# EAGLE design magnetic_encoder (EAGLE 7.2.0)
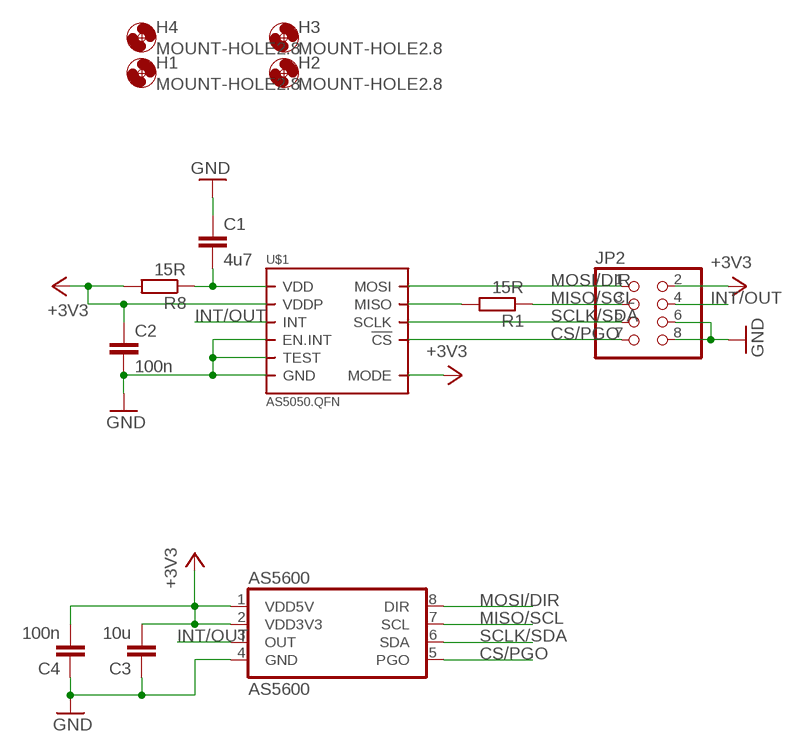
[diagram p0: schematic, sheet 1]

## Parts
AS5600  AS5600  [SOIC-8]
C1  4u7  C-EUC0603  [C0603]
C2  100n  C-EUC0603  [C0603]
C3  10u  C-EUC0603  [C0603]
C4  100n  C-EUC0603  [C0603]
H1  MOUNT-HOLE2.8  [2,8]
H2  MOUNT-HOLE2.8  [2,8]
H3  MOUNT-HOLE2.8  [2,8]
H4  MOUNT-HOLE2.8  [2,8]
JP2  PINHD-2X4  [2X04]
R1  15R  R-EU_R0603  [R0603]
R8  15R  R-EU_R0603  [R0603]
U$1  AS5050.QFN  [QFN.16]

## Nets
+3V3: AS5600.1(VDD5V) AS5600.2(VDD3V3) C2.1 C3.2 C4.2 JP2.2 R8.2 U$1.11(VDDP) U$1.14(MODE)
CS/PGO: AS5600.5(PGO) JP2.7 U$1.4(!CS)
GND: AS5600.4(GND) C1.1 C2.2 C3.1 C4.1 JP2.6 JP2.8 U$1.9(TEST) U$1.10(EN.INT) U$1.13(GND)
INT/OUT: AS5600.3(OUT) JP2.4 U$1.15(INT)
MISO/SCL: AS5600.7(SCL) JP2.3 R1.1
MOSI/DIR: AS5600.8(DIR) JP2.1 U$1.1(MOSI)
N$1: C1.2 R8.1 U$1.12(VDD)
N$3: R1.2 U$1.2(MISO)
SCLK/SDA: AS5600.6(SDA) JP2.5 U$1.3(SCLK)

## Library data of the parts
AS5600 = austriamicrosystems:AS5600
C1-C4 = rcl:C-EU: CAPACITOR, European symbol
H1-H4 = holes:MOUNT-HOLE: MOUNTING HOLE with drill center marker
JP2 = Headerlibrary:PINHD-2X4: PIN HEADER
R1 R8 = rcl:R-EU_: RESISTOR, European symbol
U$1 = austriamicrosystems:AS5050

## Net classes
0 default: width 0.203 mm

## Board
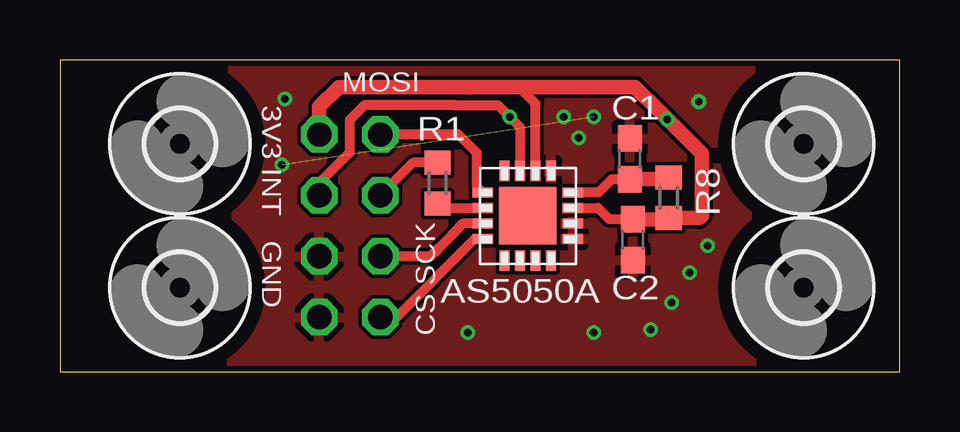
[diagram p1: board, top side]
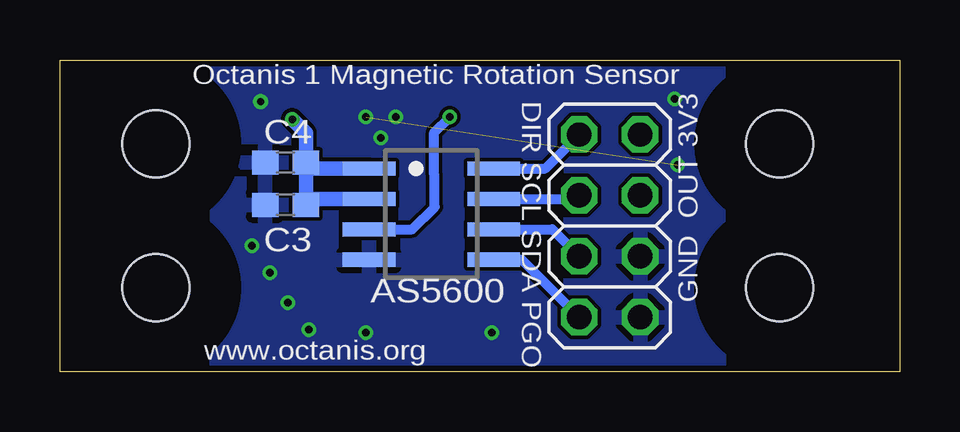
[diagram p2: board, bottom side, seen from below]

Size 35 x 13 mm. Coordinates in mm from the lower left corner, seen from the top.
Outline: 0,0 35,0 35,13 0,13 0,0
Copper layers (1*16): Top 0.035mm / dielectric 1.5mm / Bottom 0.035mm
Design rules "SeeedStudio_2layer_DRU_no_angle_20140221": minimum track width 6mil, minimum drill 12mil, track to track 6mil, track to pad 6mil, pad to pad 6mil, via to via 6mil, smd to smd 0mil, copper to edge 10mil, drill to drill 10mil, minimum pad ring 10mil, minimum via ring 6mil, stop-mask expansion 2mil, vias tented up to drill 100mil, thermal gap 10mil

### Footprints (pad centres in the part's own frame; a part is rotated, then mirrored left to right if it is on the bottom)
SOIC-8 = smd 0.6 x 2.2: 1 -1.215,-2.62; 2 0.055,-2.62; 3 1.325,-2.62; 4 2.595,-2.62; 5 2.595,2.58; 6 1.325,2.58; 7 0.055,2.58; 8 -1.215,2.58
C0603 = smd 1.1 x 1: 1 -0.85,0; 2 0.85,0
2,8 = hole 2.8: 0,0
2X04 = drill 1.016 octagon: 1 -3.81,-1.27; 2 -3.81,1.27; 3 -1.27,-1.27; 4 -1.27,1.27; 5 1.27,-1.27; 6 1.27,1.27; 7 3.81,-1.27; 8 3.81,1.27
R0603 = smd 1 x 1.1: 1 -0.85,0; 2 0.85,0
QFN.16 = smd 0.85 x 0.42: 1 -1.875,0.975; 2 -1.875,0.325; 3 -1.875,-0.325; 4 -1.875,-0.975; 9 1.875,-0.975; 10 1.875,-0.325; 11 1.875,0.325; 12 1.875,0.975 | smd 0.42 x 0.85: 5 -0.975,-1.875; 6 -0.325,-1.875; 7 0.325,-1.875; 8 0.975,-1.875; 13 0.975,1.875; 14 0.325,1.875; 15 -0.325,1.875; 16 -0.975,1.875 | smd 2.4 x 2.4: PAD 0,0

### Placement (x,y rotation side)
AS5600  19.5,7.25 270 bottom
C1  23.75,8.88 270 top
C2  23.88,5.5 270 top
C3  25.6,6.95 0 bottom
C4  25.6,8.71 0 bottom
H1  5,9.5 0 top
H2  5,3.5 0 top
H3  31,9.5 0 top
H4  31,3.5 0 top
JP2  12.08,6.08 270 bottom
R1  15.74,7.87 270 top
R8  25.38,7.25 270 top
U$1  19.5,6.5 0 top

### Tracks (layer width: path | path; a pad name or v marks a point on that pad's centre or on a via)
+3V3  (via drill 0.3)
  Top 0.406: 17.11,11.76 17.11,11.87 | U$1.14 19.82,11.17 19.12,11.87 | U$1.11 22.43,6.83 22.88,6.38 23.85,6.38 C2.1 23.93,6.4
  Top 0.61: JP2.2 10.81,11.06 11.62,11.87 17.11,11.87 17.26,11.87 19.12,11.87 23.97,11.87 24.96,10.88 | v25.32,10.52 24.96,10.88 | 23.74,6.08 C2.1 25.32,6.35 R8.2 26.65,6.4 26.75,6.5 26.75,9.09 v25.32,10.52 | v25.32,10.52 24.96,10.88
  Bottom 0.61: 24.75,7.2 AS5600.2 | AS5600.1 24.5,8.47 arc90 C4.2 | C4.2 24.75,9.74 arc-90 24.75,9.75 24.75,9.96 v25.32,10.52 | 24.75,7.2 C3.2 24.75,7.2 | 24.75,7.2 C4.2
CS/PGO
  Top 0.406: U$1.4 17.27,5.53 14,2.25 13.37,2.25 JP2.7
  Bottom 0.406: AS5600.5 15.74,4.66 JP2.7
GND  (via drill 0.3)  (1 unrouted)
  other vias: 22.25,10.62 21,10.62 21.62,9.75 25.5,2.88 26.25,4.12 27,5.25 9.38,11.38 26.64,11.26 9.25,8.62 24.62,1.75 22.25,1.62 17,1.62
  pour Top: 0,13 35,13 35,0 0,0
  pour Bottom: 0,13 35,13 35,0 0,0
INT/OUT  (via drill 0.3)
  Top 0.406: JP2.4 10.81,7.86 12.08,9.12 12.08,10.5 12.69,11.11 16.5,11.11 18.27,11.11 18.38,11 | 18.38,11 v18.75,10.62 | v18.75,10.62 19.12,10.25 19.18,10.2 U$1.15 | v18.75,10.62 18.38,11
  Bottom 0.406: v18.75,10.62 19.4,9.98 19.4,8.21 19.4,6.88 19.38,6.88 20.32,5.93 AS5600.3
MISO/SCL
  Top 0.406: 13.54,7.54 JP2.3 14.72,8.72 R1.1
  Bottom 0.406: AS5600.7 13.5,7.2 JP2.3
MOSI/DIR
  Top 0.406: U$1.1 17.38,7.72 17.38,9.12 16.61,9.89 JP2.1
  Bottom 0.406: AS5600.8 14.77,8.47 JP2.1
N$1
  Top 0.406: U$1.12 22.46,7.47 22.5,7.51 23.01,8.03 C1.2 23.82,8.1
  Top 0.61: R8.1 25.3,8.03 C1.2
N$3
  Top 0.406: R1.2 15.93,6.83 U$1.2
SCLK/SDA
  Top 0.406: U$1.3 16.8,6.17 16.38,5.75 15.75,5.12 15.43,4.81 JP2.5
  Bottom 0.406: 13.5,4.96 JP2.5 14.47,5.93 AS5600.6

### Text on the board
tNames: MOSI | 3V3 INT GND | AS5050A | CS SCK
bNames: Octanis 1 Magnetic Rotation Sensor | DIR SCL SDA PGO | GND OUT 3V3 | www.octanis.org